# Altium schematic sheet chicker.SchDoc
size A4; SheetNumber: 7
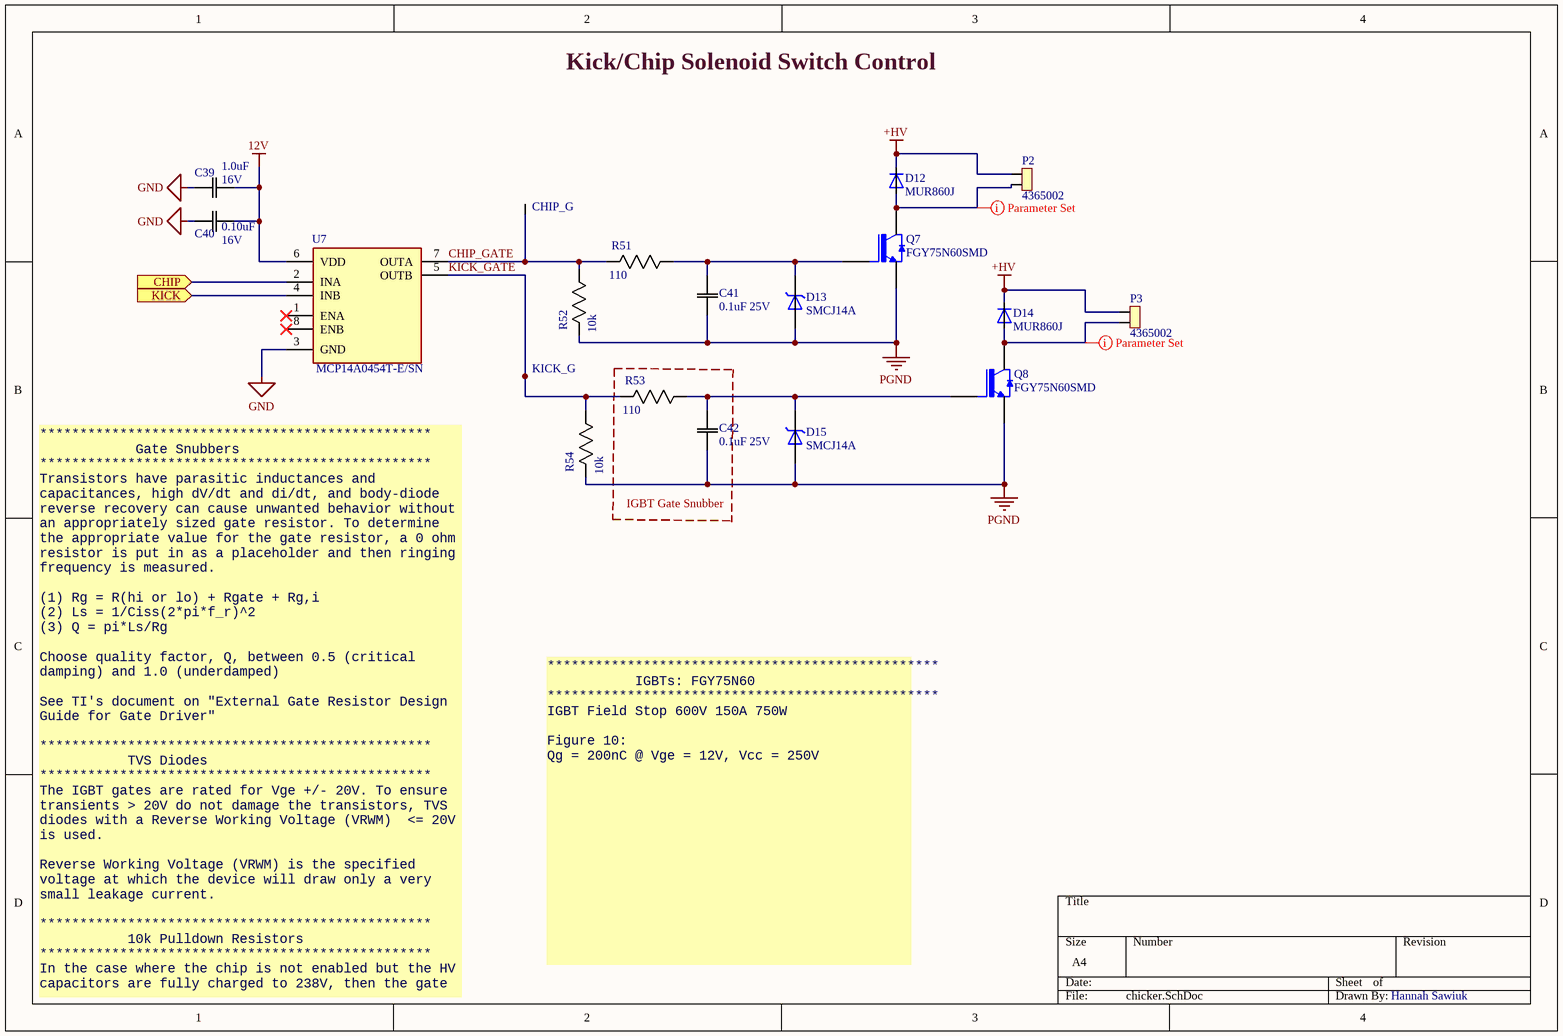
[diagram p0: chicker.SchDoc]

## Parts
C39  Rating: 16V  [0603]  (hidden comment: 1.0uF)
C40  Rating: 16V  [0603]  (hidden comment: 0.10uF)
C41  0.1uF 25V  [0603]
C42  0.1uF 25V  [0603]
CHIP_G  Test Point (Via)  [TP]  (value not drawn)
D12  MUR860J  [DO-214AB-DIODES]
D13  SMCJ14A  [DIOM7959X262N]
D14  MUR860J  [DO-214AB-DIODES]
D15  SMCJ14A  [DIOM7959X262N]
KICK_G  Test Point (Via)  [TP]  (value not drawn)
P2  4365002  [43650-02]
P3  4365002  [43650-02]
Q7  FGY75N60SMD  [TO-247-3 - FaceDown]
Q8  FGY75N60SMD  [TO-247-3 - FaceDown]
R51  110  [0603]
R52  10k  [0603]
R53  110  [0603]
R54  10k  [0603]
U7  MCP14A0454T-E/SN  [8-SOIC]

## Ports
CHIP (in), KICK (in)

## Nets
12V: C39.2(C2) C40.2(C2) U7.6(VDD)
+HV: D12.1(C) D14.1(C) P2.1 P3.1
GND: C39.1(C1) C40.1(C1) U7.3(GND)
PGND: C41.1(C1) C42.1(C1) D13.A D15.A Q7.3(E) Q8.3(E) R52.2(R2) R54.2(R2)
CHIP: U7.2(INA) ; port CHIP
CHIP_GATE: CHIP_G.1 R51.2(R2) R52.1(R1) U7.7(OUTA)
KICK: U7.4(INB) ; port KICK
KICK_GATE: KICK_G.1 R53.2(R2) R54.1(R1) U7.5(OUTB)
NetC41_2: C41.2(C2) D13.C Q7.1(G) R51.1(R1)
NetC42_2: C42.2(C2) D15.C Q8.1(G) R53.1(R1)
NetD12_2: D12.2(A) P2.2 Q7.2(C)
NetD14_2: D14.2(A) P3.2 Q8.2(C)

Not connected (* = marked no-connect by the designer): U7 1(ENA)* 8(ENB)*

## Layout directives
net class HighVoltage: NetD12_2, NetD14_2

## Notes on the sheet
- Kick/Chip Solenoid Switch Control
- IGBT Gate Snubber
- *************************************************
  IGBTs: FGY75N60
  *************************************************
  IGBT Field Stop 600V 150A 750W
  Figure 10:
  Qg = 200nC @ Vge = 12V, Vcc = 250V
- *************************************************
  Gate Snubbers
  *************************************************
  Transistors have parasitic inductances and capacitances, high dV/dt and di/dt, and body-diode reverse recovery can cause unwanted behavior without an appropriately sized gate resistor. To determine the appropriate value for the gate resistor, a 0 ohm resistor is put in as a placeholder and then ringing frequency is measured.
  (1) Rg = R(hi or lo) + Rgate + Rg,i
  (2) Ls = 1/Ciss(2*pi*f_r)^2
  (3) Q = pi*Ls/Rg
  Choose quality factor, Q, between 0.5 (critical damping) and 1.0 (underdamped)
  See TI's document on "External Gate Resistor Design Guide for Gate Driver"
  *************************************************
  TVS Diodes
  *************************************************
  The IGBT gates are rated for Vge +/- 20V. To ensure transients > 20V do not damage the transistors, TVS diodes with a Reverse Working Voltage (VRWM)  <= 20V is used.
  Reverse Working Voltage (VRWM) is the specified voltage at which the device will draw only a very small leakage current.
  *************************************************
  10k Pulldown Resistors
  *************************************************
  In the case where the chip is not enabled but the HV capacitors are fully charged to 238V, then the gate of the IGBTs would be floating, and there could be the case where the gate rises above 12V, turning the IGBTs on. This could lead to a safety hazard due to the uncontrolled kicker/chipper action. By pulling down the gates with a 10k resistor, the IGBTs will remain off whenever the gate driver is not enabled.
- Hannah Sawiuk

## Library data of the parts
C39 = CAP 1.0uF 16V: CAP CER 1.0UF 16V X5R 0603/0805; Tolerance: 10%; Package: 0603/0805; Temperature Coefficient: X5R; Operating Temperature: -55°C ~ 85°C; Value: 1.0uF
C40 = CAP 0.10uF 16V: CAP CER 0.10UF 16V X5R 0603/0805; Tolerance: 10%; Package: 0603/0805; Temperature Coefficient: X5R; Operating Temperature: -55°C ~ 85°C; Value: 0.10uF
C41 C42 = CAP 0.1uF 25V: CAP CER 0.1UF 25V X7R 0805/0603; Tolerance: 10%; Value: 0.1uF; Temperature Coefficient: X7R; Rating: 25V; Operating Temperature: -55°C ~ 125°C
D12 D14 = DIODE FAST 600V 8A: Diode Standard 600 V 8A Surface Mount SMC; ComponentLink1Description: Octopart Link; ComponentLink1URL: https://octopart.com/search?q=MUR860J&currency=USD&specs=0; Supplier 1: DigiKey; Supplier Part Number 1: 1740-MUR860JCT-ND; Supplier 2: Digi-Key; Supplier Part Number 2: 1740-MUR860JCT-ND; Supplier 3: Newark; Supplier Part Number 3: 37AJ9020; Supplier 4: Mouser; Supplier Part Number 4: 771-MUR860J
D13 D15 = DIODE TVS 14VR 15.6VBR: 23.2V Clamp 64.7A Ipp Tvs Diode Surface Mount DO-214AB (SMC), VR = 14V, VBR = 15.6V; Package: None; Price: None; Value: *; MP: SMCJ14A; Availability: Unavailable; Supplier 1: Digi-Key; Supplier 2: Mouser; Supplier Part Number 1: SMCJ14ABCT-ND; Supplier Part Number 2: 652-SMCJ14A
P2 P3 = CN MOLEX 4365002XX: MOLEX MICROFIT 2CKT RIGHT THRU; MF: MOLEX; MP: 4365002XX; Digikey: WM17581-ND; Digikey Link: https://www.digikey.com/en/products/detail/molex/0436500205/3310532?s=N4IgTCBcDaICwGYBsBWADGsaUgLoF8g; Package: Microfit; Price: 1.44 CAD; Value: N/A; Supplier Part Number 2: WM17581-ND; Supplier 1: Digi-Key; Supplier Part Number 1: WM6264CT-ND; Supplier 2: Newark; Supplier Part Number 2: 57H0300; Supplier 3: Mouser; Supplier Part Number 3: 538-43650-0210
Q7 Q8 = FGY75N60SMD: IGBT Field Stop 600V 150A 750W Through Hole PowerTO-247-3; MF: ON Semiconductor; Vge max: ±20V; Topology: Field Stop IGBT; Vce max: 600V; Package: TO-247 Fairchild Semiconductor; MP: FGY75N60SMD; Ic max: 150A; Power: 750W; Supplier 1: Digi-Key; Supplier Part Number 1: FGY75N60SMDFS-ND
R51 R53 = RES 110.0 1/8W - 1%: RES SMD 110 OHM 1% 1/8W 0805/0603; Power (Watts): 0.125W; Package: 0805; Value: 110; Tolerance: 1%
R52 R54 = RES 10k 1/8W - 1%: RES SMD 10K OHM 1% 1/8W 0805/0603; Power (Watts): 0.125W; Package: 0805; Value: 10k; Tolerance: 1%
U7 = MCP14A0454T-E/SN: Low-Side Gate Driver IC Non-Inverting 8-SOIC; Supplier 1: Digi-Key; Supplier Part Number 1: MCP14A0454T-E/SNCT-ND; Supplier 2: Mouser; Supplier Part Number 2: 579-MCP14A0454TE/SN